# Altium schematic sheet RC_Inverter.SchDoc
size A4
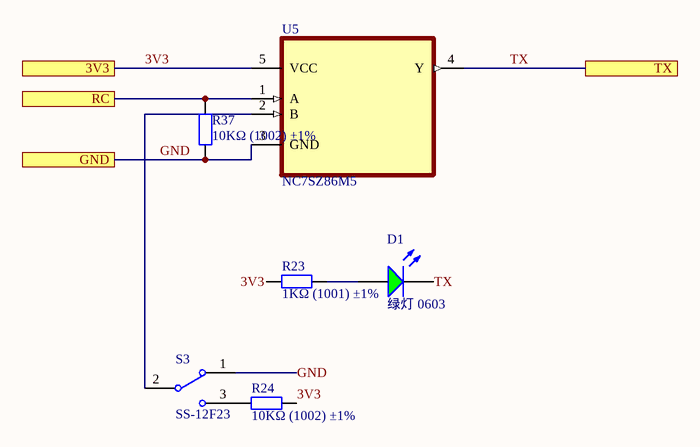
[diagram p0: RC_Inverter.SchDoc]

## Parts
D1  绿灯 0603  [0603_LED_S1]
R23  1KΩ (1001) ±1%  [0402_R]
R24  10KΩ (1002) ±1%  [0402_R]
R37  10KΩ (1002) ±1%  [0402_R]
S3  SS-12F23  [MSK-12C01-07]
U5  NC7SZ86M5  [SOT95P280X145-5N]

## Ports
3V3, GND, RC, TX

## Nets
3V3: R23.1 R24.2 U5.5(VCC) ; port 3V3
GND: R37.2 S3.1 U5.3(GND) ; port GND
RC: R37.1 U5.1(A) ; port RC
TX: D1.K U5.4(Y) ; port TX
NetD1_A: D1.A R23.2
NetR24_1: R24.1 S3.3
NetS3_2: S3.2 U5.2(B)

## Library data of the parts
D1 = 0603 绿灯: 发光二极管; ComponentLink1Description: 供应商链接; ComponentLink1URL: http://www.szlcsc.com/product/details_73152.html; Package: 0603; Supplier: LC; SuppliersPartNumber: C72043
R23 = 0402 1KΩ (1001) 1%: 贴片电阻; ComponentLink1Description: 供应商链接; ComponentLink1URL: http://www.szlcsc.com/product/details_12256.html; Package: 0402; Supplier: LC; SuppliersPartNumber: C11702
R24 R37 = 0402 10KΩ (1002) 1%: 贴片电阻; ComponentLink1Description: 供应商链接; ComponentLink1URL: http://www.szlcsc.com/product/details_26487.html; Package: 0402; Supplier: LC; SuppliersPartNumber: C25744
S3 = SSW-1P: 1路波动开关; BOM名称: 波动开关; 版权归属: 源创客; 学习资源: www.ooocke.com
U5 = NC7SZ86M5: XOR _Exclusive OR_ IC 1 Channel SOT-23-5; MF: ON Semiconductor; Value: *; MP: NC7SZ86M5; Package: SOT-23 ON Semiconductor; Price: None; SnapEDA_Link: https://www.snapeda.com/parts/NC7SZ86M5/ON%20Semiconductor/view-part/2718212/?ref=snap; Availability: Unavailable